# EAGLE design main_10 (EAGLE 5.11)
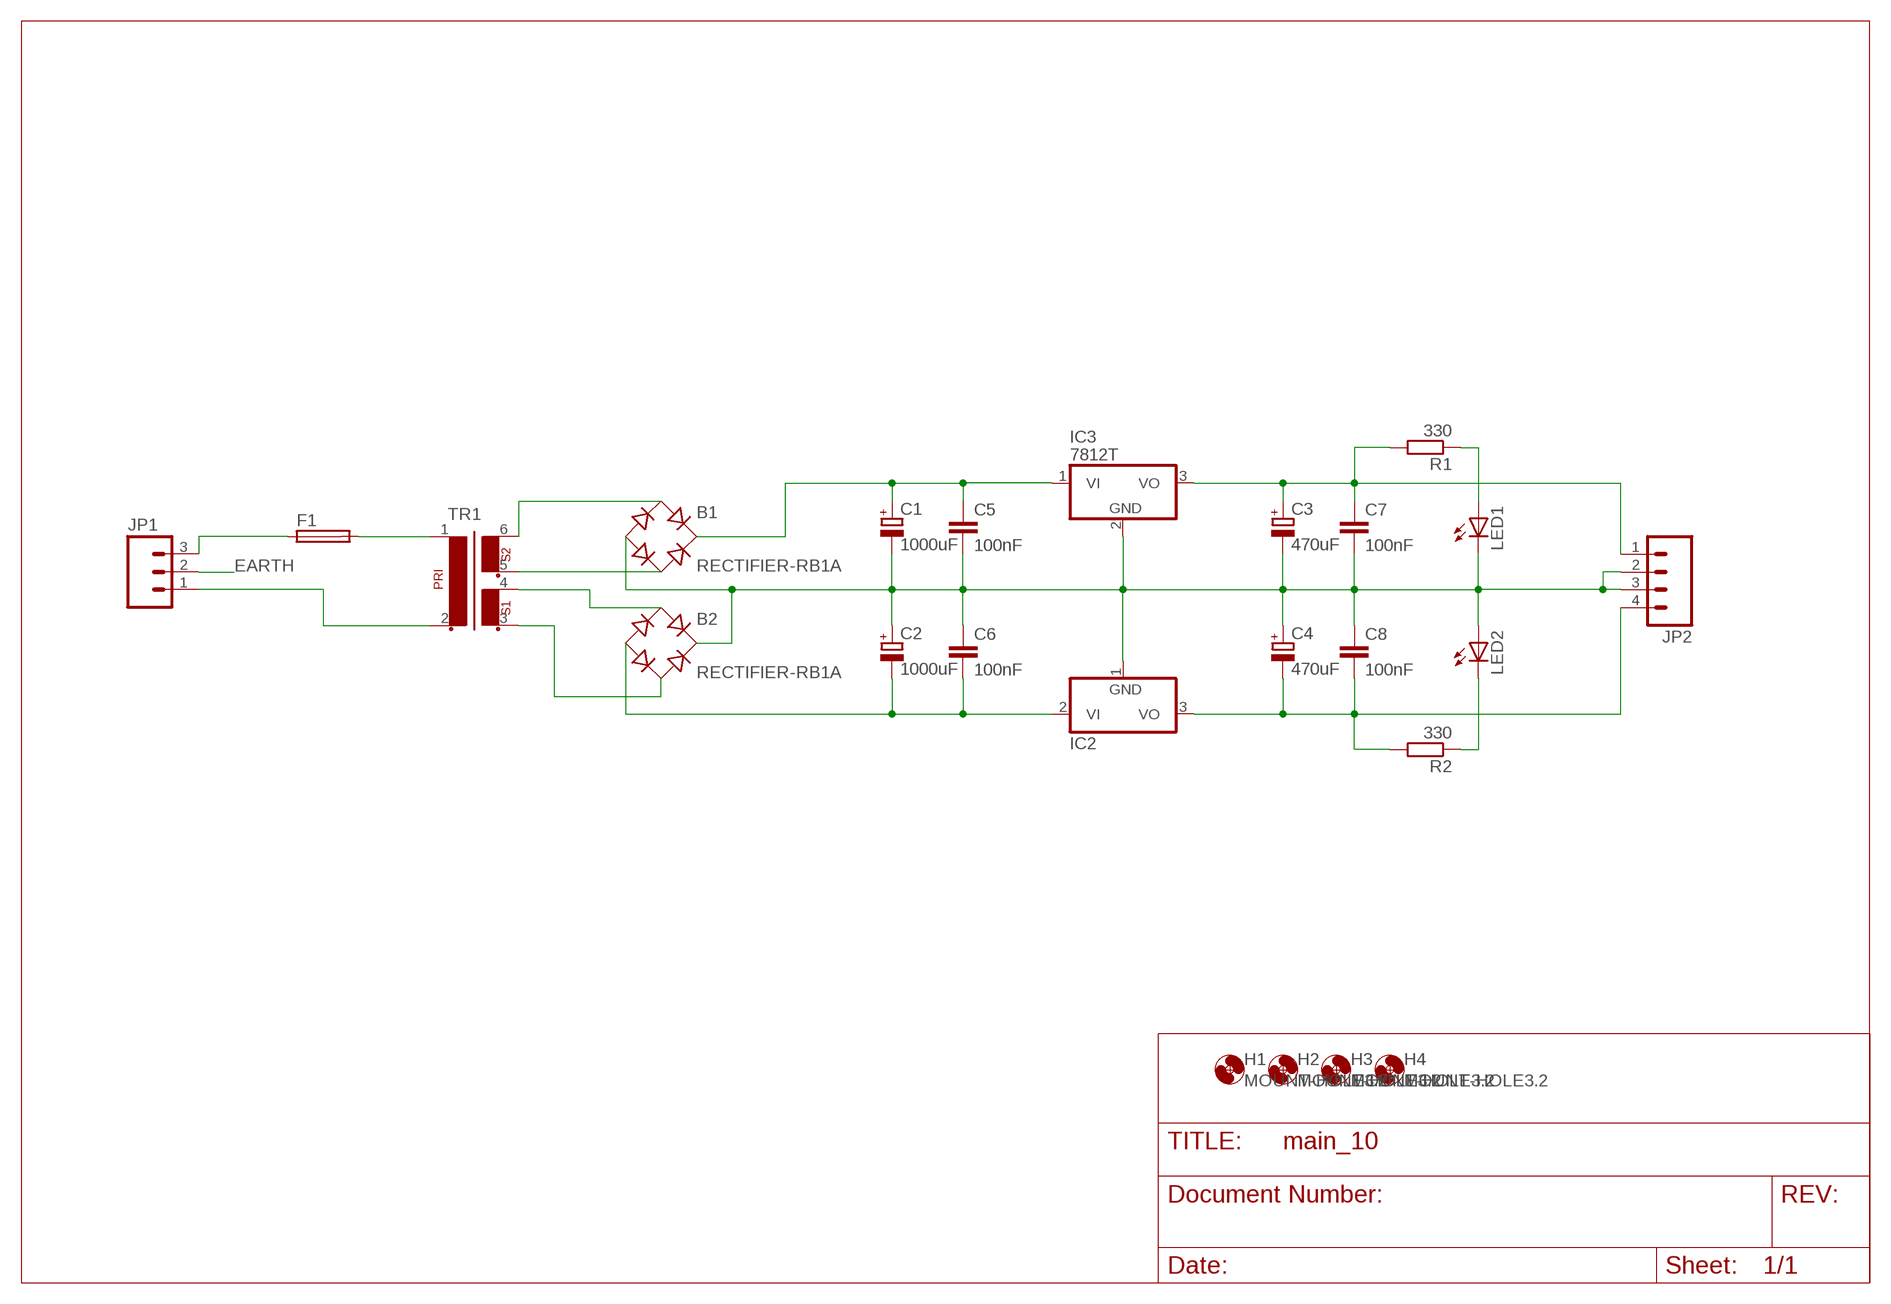
[diagram p0: schematic, sheet 1]

## Parts
B1  RECTIFIER-RB1A  [RB1A]
B2  RECTIFIER-RB1A  [RB1A]
C1  1000uF  CPOL-EUE5-13  [E5-13]
C2  1000uF  CPOL-EUE5-13  [E5-13]
C3  470uF  CPOL-EUE3.5-8  [E3,5-8]
C4  470uF  CPOL-EUE3.5-8  [E3,5-8]
C5  100nF  CAPPTH1  [CAP-PTH-5MM]
C6  100nF  CAPPTH1  [CAP-PTH-5MM]
C7  100nF  CAPPTH1  [CAP-PTH-5MM]
C8  100nF  CAPPTH1  [CAP-PTH-5MM]
F1  SH22,5A  [SH22,5A]
H1  MOUNT-HOLE3.2  [3,2]
H2  MOUNT-HOLE3.2  [3,2]
H3  MOUNT-HOLE3.2  [3,2]
H4  MOUNT-HOLE3.2  [3,2]
IC2  7912T  [TO220H]
IC3  7812T  [TO220H]
JP1  M03-SCREW-5MM  [SCREWTERMINAL-5MM-3]
JP2  M04SCREW  [SCREWTERMINAL-3.5MM-4]
LED1  LED5MM-KIT  [LED5MM-KIT]
LED2  LED5MM-KIT  [LED5MM-KIT]
R1  330  R-EU_0207/10  [0207/10]
R2  330  R-EU_0207/10  [0207/10]
TR1  VC16/2/15  [VC16/2/15]

## Nets
EARTH: JP1.2
N$1: C3.+ C7.1 IC3.3(VO) JP2.1 R1.2
N$2: B1.AC2 TR1.5
N$3: B1.- B2.+ C1.- C2.+ C3.- C4.+ C5.2 C6.1 C7.2 C8.1 IC2.1(GND) IC3.2(GND) JP2.2 JP2.3 LED1.K(C) LED2.A
N$4: B1.+ C1.+ C5.1 IC3.1(VI)
N$5: LED1.A R1.1
N$6: B2.- C2.- C6.2 IC2.2(VI)
N$7: B1.AC1 TR1.6
N$8: B2.AC1 TR1.4
N$9: B2.AC2 TR1.3
N$10: C4.- C8.2 IC2.3(VO) JP2.4 R2.2
N$11: LED2.K(C) R2.1
N$14: F1.2 TR1.1
N$15: F1.1 JP1.3
N$16: JP1.1 TR1.2

## Library data of the parts
B1 B2 = rectifier:RECTIFIER-: Rectifier
C1-C4 = rcl:CPOL-EU: POLARIZED CAPACITOR, European symbol
C5-C8 = SparkFun:CAP: Capacitor Standard 0603 ceramic capacitor, and 0.1" leaded capacitor.
F1 = fuse:SH22,5A: FUSE HOLDER grid 22,5mm, isolated cap OGN0031 8201, Schurter (Buerklin); MPN: 0031.7701.11; OC_FARNELL: unknown; OC_NEWARK: 04F1224
H1-H4 = holes:MOUNT-HOLE: MOUNTING HOLE with drill center marker
IC2 = linear:79*: Negative VOLTAGE REGULATOR
IC3 = linear:78*: Positive VOLTAGE REGULATOR Source: http://cache.national.com/ds/LM/LM78L05.pdf http://www.fairchildsemi.com/ds/LM/LM7805.pdf
JP1 = SparkFun:M03: Header 3 Standard 3-pin 0.1" header. Use with straight break away headers (SKU : PRT-00116), right angle break away headers (PRT-00553), swiss pins (PRT-00743), machine pins (PRT-00117), and female headers (PRT-00115). Molex polarized connector foot print use with SKU : PRT-08232 with associated crimp pins and housings.
JP2 = SparkFun:M04: Header 4 Standard 4-pin 0.1" header. Use with straight break away headers (SKU : PRT-00116), right angle break away headers (PRT-00553), swiss pins (PRT-00743), machine pins (PRT-00117), and female headers (PRT-00115). Molex polarized connector foot print use with SKU : PRT-08231 with associated crimp pins and housings. 1MM SMD Version SKU: PRT-10208
LED1 LED2 = SparkFun:LED: LEDs Standard schematic elements and footprints for 5mm, 3mm, 1206, and 0603 sized LEDs. 5mm - Spark Fun Electronics SKU : COM-00529 (and others)
R1 R2 = rcl:R-EU_: RESISTOR, European symbol
TR1 = OSHW:VC16/2/15: TRANSFORMER 1 primary winding, 2 secondary windings BLOCK

## Board
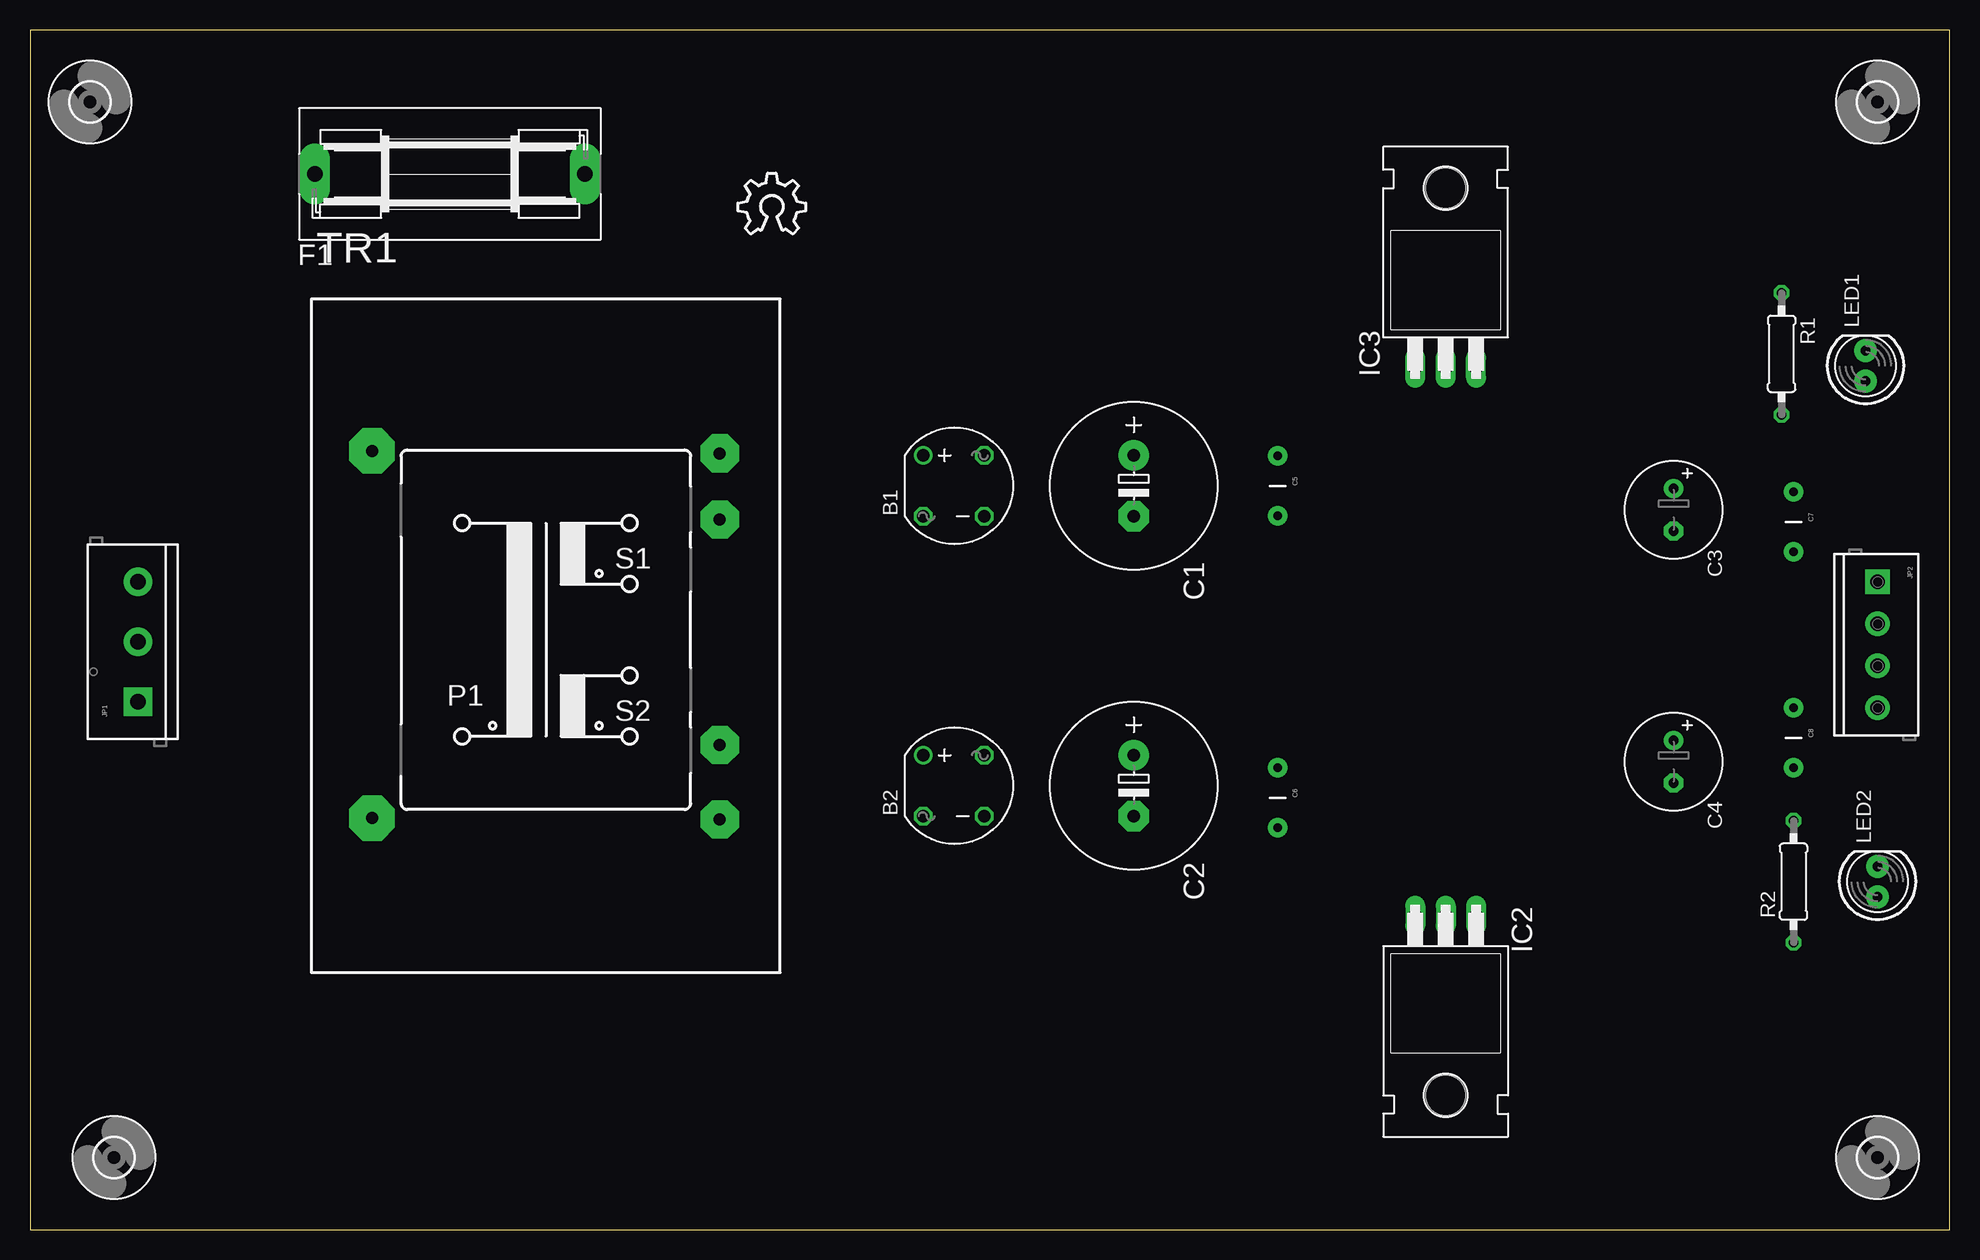
[diagram p1: board, top side]
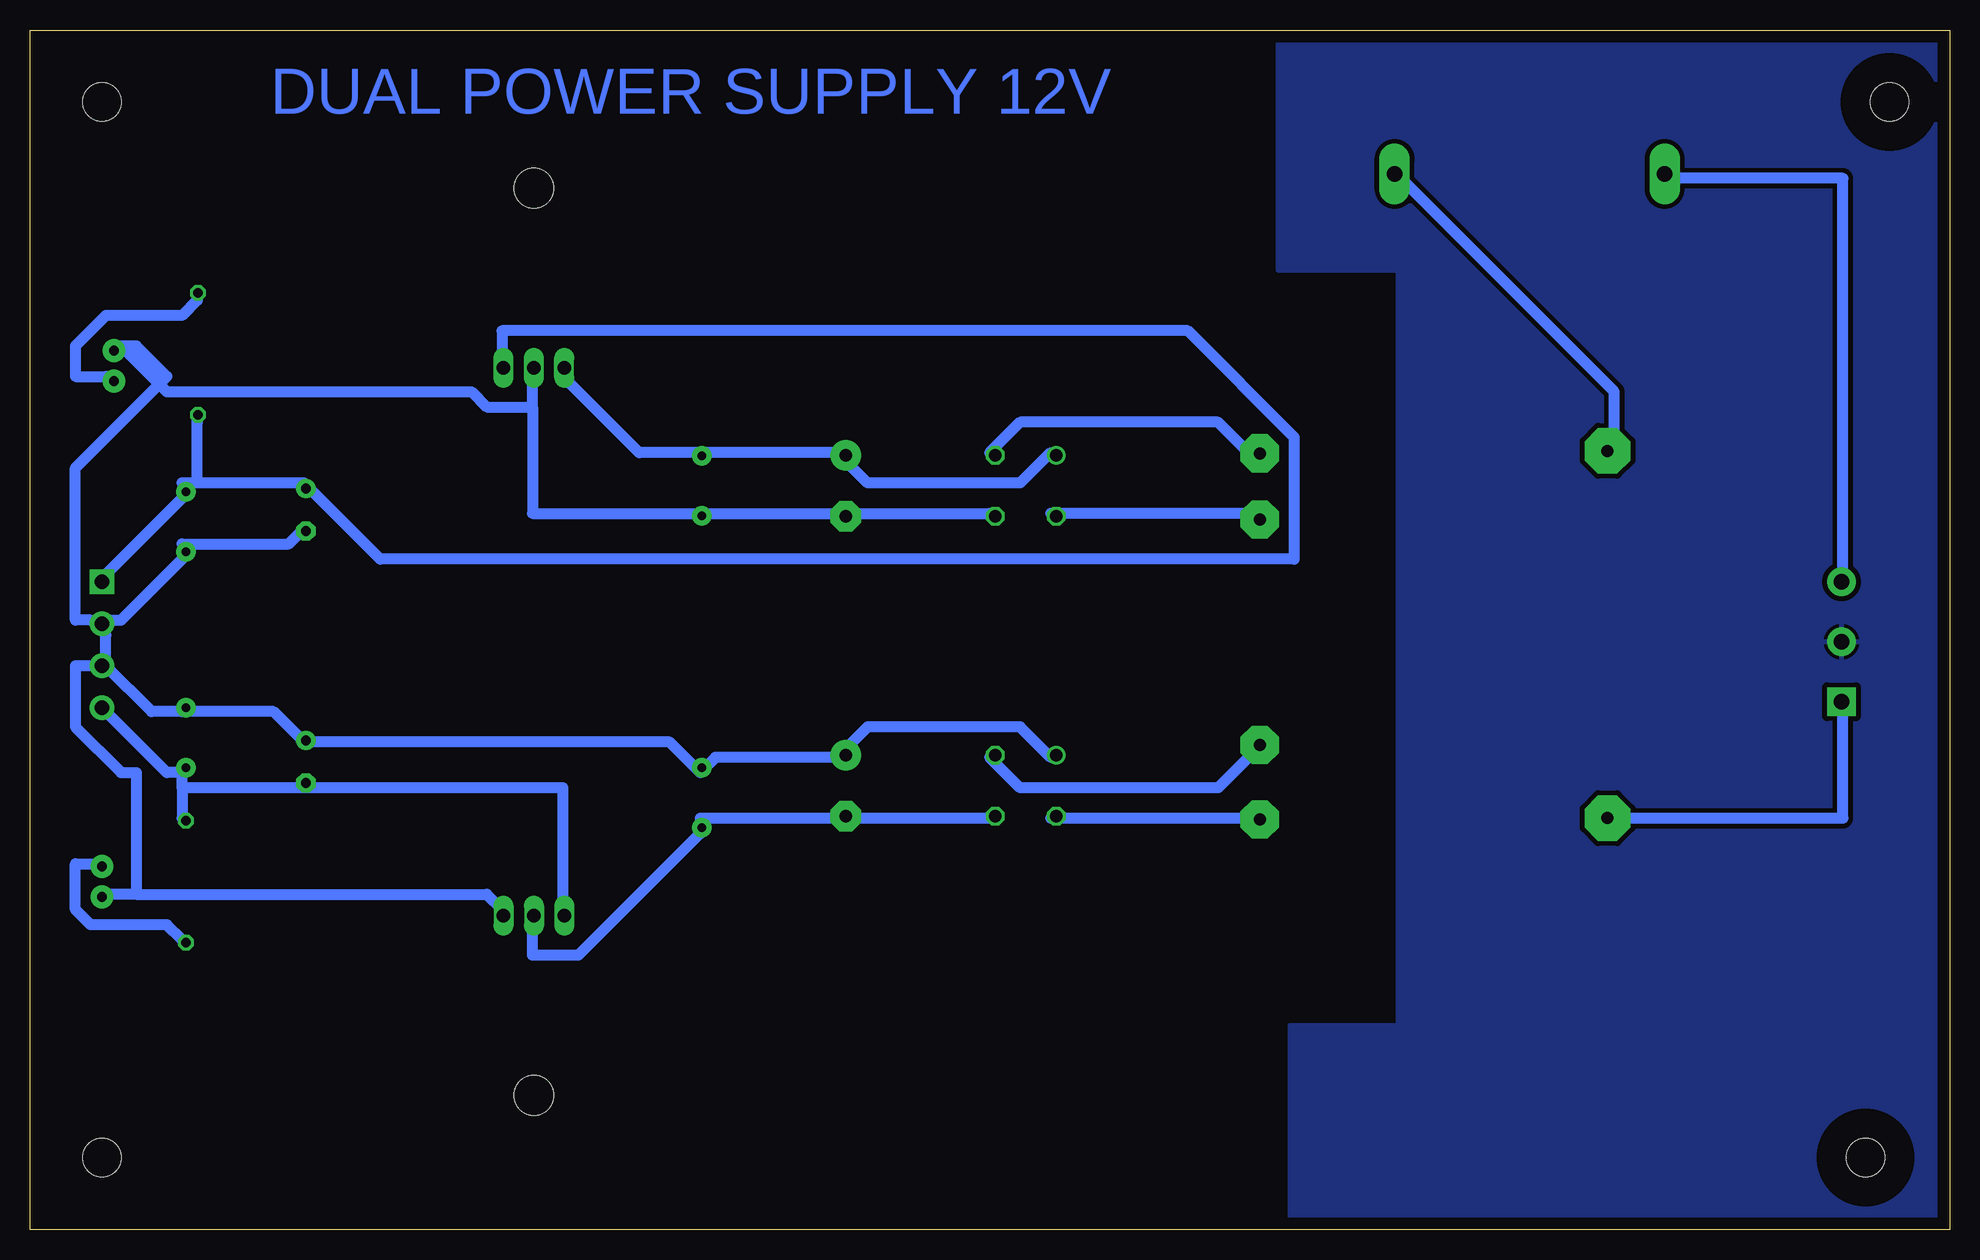
[diagram p2: board, bottom side, seen from below]

Size 160 x 100 mm. Coordinates in mm from the lower left corner, seen from the top.
Outline: 0,0 160,0 160,100 0,100 0,0
Copper layers (1*16): Top 0.035mm / dielectric 1.5mm / Bottom 0.035mm
Design rules "default *": minimum track width 36mil, minimum drill 24mil, track to track 16mil, track to pad 24mil, pad to pad 8mil, via to via 8mil, smd to smd 8mil, copper to edge 40mil, drill to drill 8mil, minimum pad ring 10mil, minimum via ring 8mil, stop-mask expansion 4mil, vias tented up to drill 0mil, thermal gap 10mil

### Footprints (pad centres in the part's own frame; a part is rotated, then mirrored left to right if it is on the bottom)
RB1A = drill 1.016 round: + -2.54,2.54 | drill 1.016 octagon: - 2.54,-2.54; AC1 2.54,2.54; AC2 -2.54,-2.54
E5-13 = drill 1.016 pad 2.54 round: + -2.54,0 | drill 1.016 pad 2.54 octagon: - 2.54,0
E3,5-8 = drill 0.813 pad 1.6 round: + -1.778,0 | drill 0.813 pad 1.6 octagon: - 1.778,0
CAP-PTH-5MM = drill 0.7 pad 1.651 round: 1 -2.5,0; 2 2.5,0
SH22,5A = drill 1.321 pad 2.54 long: 1 -11.252,0; 2 11.252,0
3,2 = hole 3.2: 0,0
TO220H = drill 1.118 long: 1 -2.54,-10.16; 2 0,-10.16; 3 2.54,-10.16 | hole 3.302: 0,4.826
SCREWTERMINAL-5MM-3 = drill 1.3 pad 2.413 square: 1 0,0 | drill 1.3 pad 2.413 round: 2 5,0; 3 10,0
SCREWTERMINAL-3.5MM-4 = drill 1.2 pad 2.032 square: 1 0,0 | drill 1.2 pad 2.032 round: 2 3.5,0; 3 7,0; 4 10.5,0
LED5MM-KIT = drill 0.813 pad 1.88 round: A -1.27,0; K 1.27,0
0207/10 = drill 0.813 octagon: 1 -5.08,0; 2 5.08,0
VC16/2/15 = drill 1 pad 3.81 octagon: 1 -12.497,20.908; 2 -12.497,-9.708 | drill 1 pad 3.175 octagon: 3 16.497,-9.808; 4 16.497,-3.604; 5 16.497,15.204; 6 16.497,20.708

### Placement (x,y rotation side)
B1  77,62 0 top
B2  77,37 0 top
C1  92,62 270 top
C2  92,37 270 top
C3  137,60 270 top
C4  137,39 270 top
C5  104,62 270 top
C6  104,36 270 top
C7  147,59 270 top
C8  147,41 270 top
F1  35,88 0 top
H1  7,6 0 top
H2  5,94 0 top
H3  154,94 0 top
H4  154,6 0 top
IC2  118,16 180 top
IC3  118,82 0 top
JP1  9,44 90 top
JP2  154,54 270 top
LED1  153,72 90 top
LED2  154,29 90 top
R1  146,73 270 top
R2  147,29 90 top
TR1  41,44 0 top
U$1  [OSHW_10X200_NOTEXT]  59,83 0 top

### Tracks (layer width: path | path; a pad name or v marks a point on that pad's centre or on a via)
EARTH
  pour Bottom: 0,100 56,100 56,80 46,80 46,17 55,17 55,0 0,0
N$1
  Bottom 0.914: 146.05,62.23 146.05,67.31 R1.2 | 146.05,62.23 147.32,62.23 C7.1 147.32,60.96 153.67,54.61 JP2.1 | 137.16,62.23 146.05,62.23 | 137.16,62.23 130.81,55.88 54.61,55.88 54.61,66.04 63.5,74.93 120.65,74.93 120.65,72.39 IC3.3 | 137.16,62.23 C3.+
N$2
  Bottom 0.914: B1.AC2 74.93,59.69 58.42,59.69 TR1.5
N$3
  Bottom 0.914: B1.- 80.01,59.69 91.44,59.69 C1.- 92.71,59.69 104.14,59.69 | 118.11,68.58 118.11,59.69 104.14,59.69 | 118.11,68.58 118.11,71.12 IC3.2 | 104.14,59.69 C5.2 | 152.4,73.66 148.59,69.85 123.19,69.85 121.92,68.58 118.11,68.58 | 151.13,27.94 153.67,27.94 LED2.A | 151.13,27.94 121.92,27.94 120.65,26.67 IC2.1 | B2.+ 74.93,39.37 77.47,41.91 90.17,41.91 91.44,40.64 C2.+ 92.71,39.37 102.87,39.37 104.14,38.1 | C3.- 137.16,58.42 138.43,57.15 147.32,57.15 C7.2 147.32,55.88 152.4,50.8 153.67,50.8 JP2.2 | 153.67,46.99 153.67,49.53 JP2.2 | 137.16,40.64 139.7,43.18 147.32,43.18 | 153.67,46.99 149.86,43.18 147.32,43.18 | 153.67,46.99 JP2.3 154.94,46.99 156.21,46.99 156.21,41.91 152.4,38.1 151.13,38.1 151.13,27.94 | 147.32,43.18 C8.1 | 104.14,38.1 106.68,40.64 137.16,40.64 | 104.14,38.1 C6.1 | 137.16,40.64 C4.+ | 152.4,73.66 151.13,73.66 148.59,71.12 156.21,63.5 156.21,50.8 154.94,50.8 JP2.2 | 152.4,73.66 LED1.K
N$4
  Bottom 0.914: B1.+ 74.93,64.77 77.47,62.23 90.17,62.23 91.44,63.5 C1.+ 92.71,64.77 104.14,64.77 | 104.14,64.77 109.22,64.77 115.57,71.12 IC3.1 | 104.14,64.77 C5.1
N$5
  Bottom 0.914: R1.1 146.05,77.47 147.32,76.2 153.67,76.2 156.21,73.66 156.21,71.12 153.67,71.12 LED1.A
N$6
  Bottom 0.914: B2.- 80.01,34.29 91.44,34.29 C2.- 92.71,34.29 104.14,34.29 C6.2 104.14,33.02 114.3,22.86 118.11,22.86 118.11,25.4 IC2.2
N$7
  Bottom 0.914: B1.AC1 80.01,64.77 77.47,67.31 60.96,67.31 58.42,64.77 TR1.6
N$8
  Bottom 0.914: B2.AC1 80.01,39.37 77.47,36.83 60.96,36.83 58.42,39.37 TR1.4
N$9
  Bottom 0.914: B2.AC2 74.93,34.29 58.42,34.29 TR1.3
N$10
  Bottom 0.914: 147.32,36.83 147.32,38.1 | 147.32,36.83 147.32,34.29 R2.2 | 137.16,36.83 147.32,36.83 | 137.16,36.83 115.57,36.83 115.57,26.67 IC2.3 | 137.16,36.83 C4.- | 147.32,38.1 148.59,38.1 153.67,43.18 JP2.4 | 147.32,38.1 C8.2
N$11
  Bottom 0.914: R2.1 147.32,24.13 148.59,25.4 154.94,25.4 156.21,26.67 156.21,30.48 153.67,30.48 LED2.K
N$14
  Bottom 0.914: F1.2 45.72,87.63 27.94,69.85 27.94,66.04 TR1.1
N$15
  Bottom 0.914: JP1.3 8.89,54.61 8.89,87.63 22.86,87.63 F1.1
N$16
  Bottom 0.914: JP1.1 8.89,43.18 8.89,34.29 27.94,34.29 TR1.2

### Text on the board
Bottom: DUAL POWER SUPPLY 12V